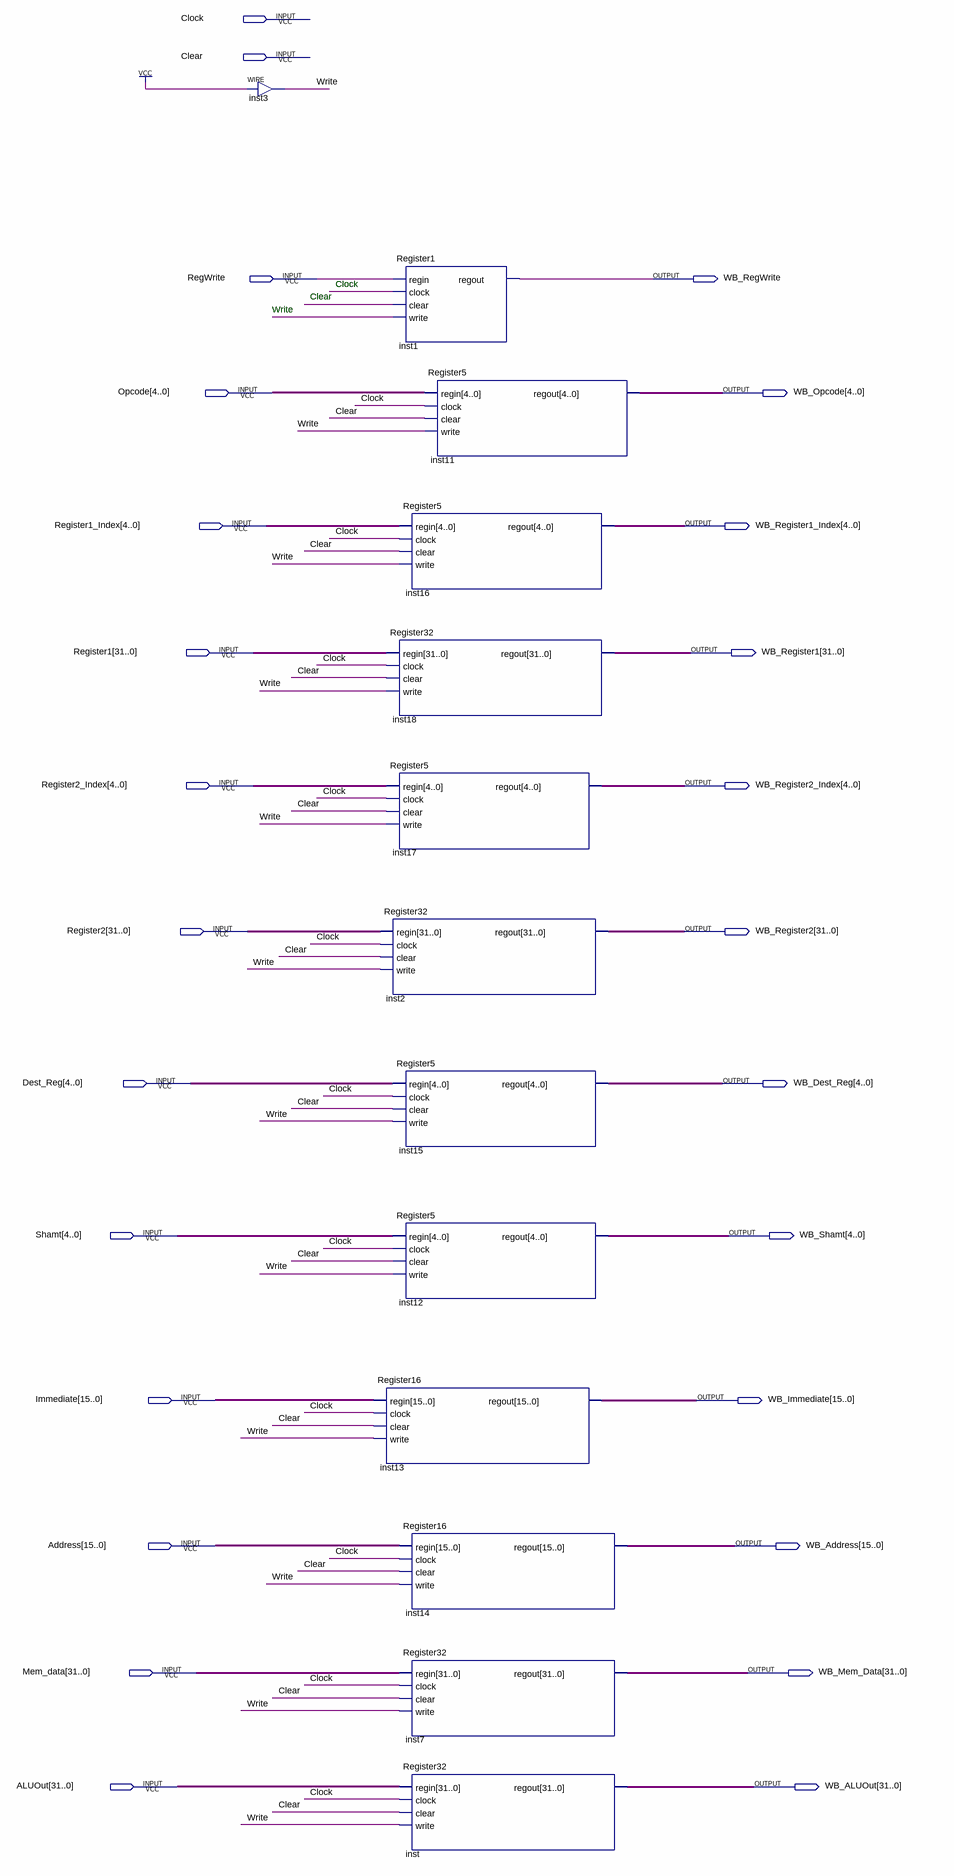
[diagram p0: schematic sheet]
// Quartus schematic EXtoWBRegs.bdf as structural Verilog: 13 symbols, 26 pins
module EXtoWBRegs (
  input  Clock,
  input  Clear,
  input  RegWrite,
  input  [4:0] Opcode,
  input  [4:0] Register1_Index,
  input  [31:0] Register1,
  input  [4:0] Register2_Index,
  input  [31:0] Register2,
  input  [4:0] Dest_Reg,
  input  [4:0] Shamt,
  input  [15:0] Immediate,
  input  [15:0] Address,
  input  [31:0] Mem_data,
  input  [31:0] ALUOut,
  output WB_RegWrite,
  output [4:0] WB_Opcode,
  output [4:0] WB_Register1_Index,
  output [31:0] WB_Register1,
  output [4:0] WB_Register2_Index,
  output [31:0] WB_Register2,
  output [4:0] WB_Dest_Reg,
  output [4:0] WB_Shamt,
  output [15:0] WB_Immediate,
  output [15:0] WB_Address,
  output [31:0] WB_Mem_Data,
  output [31:0] WB_ALUOut
);

  wire Write;

  assign Write = 1'b1;  // WIRE inst3
  Register32 inst2 (.regin(Register2), .clock(Clock), .clear(Clear), .write(Write), .regout(WB_Register2));
  Register16 inst13 (.regin(Immediate), .clock(Clock), .clear(Clear), .write(Write), .regout(WB_Immediate));
  Register1 inst1 (.regin(RegWrite), .clock(Clock), .clear(Clear), .write(Write), .regout(WB_RegWrite));
  Register5 inst11 (.regin(Opcode), .clock(Clock), .clear(Clear), .write(Write), .regout(WB_Opcode));
  Register5 inst16 (.regin(Register1_Index), .clock(Clock), .clear(Clear), .write(Write), .regout(WB_Register1_Index));
  Register32 inst18 (.regin(Register1), .clock(Clock), .clear(Clear), .write(Write), .regout(WB_Register1));
  Register5 inst17 (.regin(Register2_Index), .clock(Clock), .clear(Clear), .write(Write), .regout(WB_Register2_Index));
  Register5 inst15 (.regin(Dest_Reg), .clock(Clock), .clear(Clear), .write(Write), .regout(WB_Dest_Reg));
  Register5 inst12 (.regin(Shamt), .clock(Clock), .clear(Clear), .write(Write), .regout(WB_Shamt));
  Register16 inst14 (.regin(Address), .clock(Clock), .clear(Clear), .write(Write), .regout(WB_Address));
  Register32 inst7 (.regin(Mem_data), .clock(Clock), .clear(Clear), .write(Write), .regout(WB_Mem_Data));
  Register32 inst (.regin(ALUOut), .clock(Clock), .clear(Clear), .write(Write), .regout(WB_ALUOut));

  // Notes on the sheet:
  //   Clock
  //   Clear
  //   Write
endmodule
